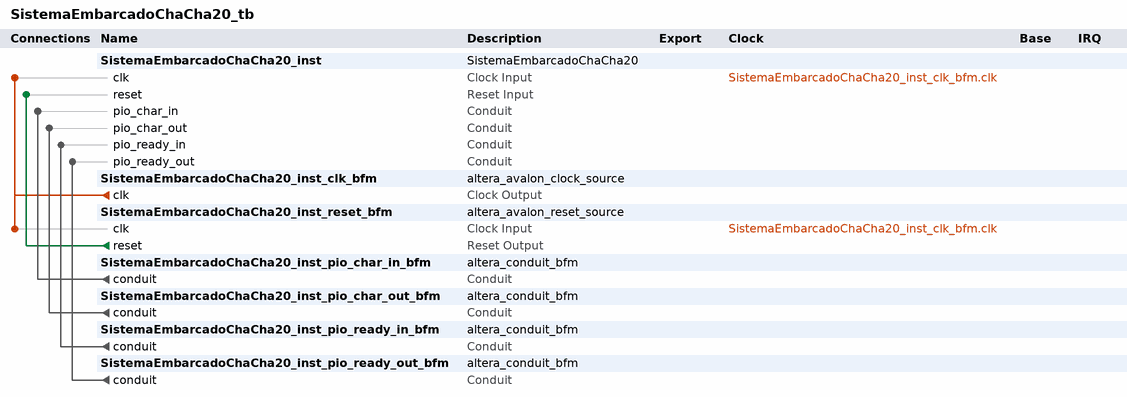
[diagram p0: system contents]
# Platform Designer (Qsys) system SistemaEmbarcadoChaCha20_tb, Cyclone IV E EP4CE115F29C7
# Parameters at their usual value, and those the tool derives, are not listed.
package require -exact qsys 18.1
create_system SistemaEmbarcadoChaCha20_tb
set_project_property DEVICE_FAMILY {Cyclone IV E}
set_project_property DEVICE EP4CE115F29C7

add_instance SistemaEmbarcadoChaCha20_inst SistemaEmbarcadoChaCha20 1.0

add_instance SistemaEmbarcadoChaCha20_inst_clk_bfm altera_avalon_clock_source 18.1

add_instance SistemaEmbarcadoChaCha20_inst_reset_bfm altera_avalon_reset_source 18.1
set_instance_parameter_value SistemaEmbarcadoChaCha20_inst_reset_bfm ASSERT_HIGH_RESET 0
set_instance_parameter_value SistemaEmbarcadoChaCha20_inst_reset_bfm INITIAL_RESET_CYCLES 50

add_instance SistemaEmbarcadoChaCha20_inst_pio_char_in_bfm altera_conduit_bfm 18.1
set_instance_parameter_value SistemaEmbarcadoChaCha20_inst_pio_char_in_bfm CLOCKED_SIGNAL false
set_instance_parameter_value SistemaEmbarcadoChaCha20_inst_pio_char_in_bfm ENABLE_RESET false
set_instance_parameter_value SistemaEmbarcadoChaCha20_inst_pio_char_in_bfm SIGNAL_DIRECTIONS output
set_instance_parameter_value SistemaEmbarcadoChaCha20_inst_pio_char_in_bfm SIGNAL_WIDTHS 8

add_instance SistemaEmbarcadoChaCha20_inst_pio_char_out_bfm altera_conduit_bfm 18.1
set_instance_parameter_value SistemaEmbarcadoChaCha20_inst_pio_char_out_bfm CLOCKED_SIGNAL false
set_instance_parameter_value SistemaEmbarcadoChaCha20_inst_pio_char_out_bfm ENABLE_RESET false
set_instance_parameter_value SistemaEmbarcadoChaCha20_inst_pio_char_out_bfm SIGNAL_DIRECTIONS input
set_instance_parameter_value SistemaEmbarcadoChaCha20_inst_pio_char_out_bfm SIGNAL_WIDTHS 8

add_instance SistemaEmbarcadoChaCha20_inst_pio_ready_in_bfm altera_conduit_bfm 18.1
set_instance_parameter_value SistemaEmbarcadoChaCha20_inst_pio_ready_in_bfm CLOCKED_SIGNAL false
set_instance_parameter_value SistemaEmbarcadoChaCha20_inst_pio_ready_in_bfm ENABLE_RESET false
set_instance_parameter_value SistemaEmbarcadoChaCha20_inst_pio_ready_in_bfm SIGNAL_DIRECTIONS output
set_instance_parameter_value SistemaEmbarcadoChaCha20_inst_pio_ready_in_bfm SIGNAL_WIDTHS 2

add_instance SistemaEmbarcadoChaCha20_inst_pio_ready_out_bfm altera_conduit_bfm 18.1
set_instance_parameter_value SistemaEmbarcadoChaCha20_inst_pio_ready_out_bfm CLOCKED_SIGNAL false
set_instance_parameter_value SistemaEmbarcadoChaCha20_inst_pio_ready_out_bfm ENABLE_RESET false
set_instance_parameter_value SistemaEmbarcadoChaCha20_inst_pio_ready_out_bfm SIGNAL_DIRECTIONS input
set_instance_parameter_value SistemaEmbarcadoChaCha20_inst_pio_ready_out_bfm SIGNAL_WIDTHS 2

# connections
add_connection SistemaEmbarcadoChaCha20_inst_clk_bfm.clk SistemaEmbarcadoChaCha20_inst.clk clock
add_connection SistemaEmbarcadoChaCha20_inst_clk_bfm.clk SistemaEmbarcadoChaCha20_inst_reset_bfm.clk clock
add_connection SistemaEmbarcadoChaCha20_inst_reset_bfm.reset SistemaEmbarcadoChaCha20_inst.reset reset
add_connection SistemaEmbarcadoChaCha20_inst_pio_char_in_bfm.conduit SistemaEmbarcadoChaCha20_inst.pio_char_in conduit
add_connection SistemaEmbarcadoChaCha20_inst_pio_char_out_bfm.conduit SistemaEmbarcadoChaCha20_inst.pio_char_out conduit
add_connection SistemaEmbarcadoChaCha20_inst_pio_ready_in_bfm.conduit SistemaEmbarcadoChaCha20_inst.pio_ready_in conduit
add_connection SistemaEmbarcadoChaCha20_inst_pio_ready_out_bfm.conduit SistemaEmbarcadoChaCha20_inst.pio_ready_out conduit

set_interconnect_requirement {$system} qsys_mm.clockCrossingAdapter HANDSHAKE
set_interconnect_requirement {$system} qsys_mm.enableEccProtection FALSE
set_interconnect_requirement {$system} qsys_mm.insertDefaultSlave FALSE
set_interconnect_requirement {$system} qsys_mm.maxAdditionalLatency 1

save_system SistemaEmbarcadoChaCha20_tb.qsys
